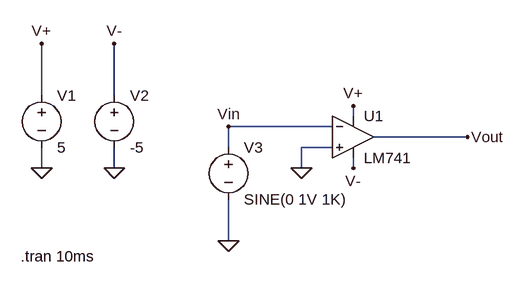
[diagram p0: schematic Lab_Task_1.asc]
Lab_Task_1.asc, the LTspice schematic file:
Version 4.1
SHEET 1 880 680
WIRE -304 96 -304 16
WIRE -192 96 -192 16
WIRE 176 128 176 112
WIRE 144 144 -16 144
WIRE 352 160 208 160
WIRE -16 176 -16 144
WIRE 144 176 96 176
WIRE -304 208 -304 176
WIRE -192 208 -192 176
WIRE 96 208 96 176
WIRE 176 208 176 192
WIRE -16 320 -16 256
FLAG 96 208 0
FLAG -16 320 0
FLAG 352 160 Vout
FLAG -16 144 Vin
FLAG -304 208 0
FLAG -192 208 0
FLAG -304 16 V+
FLAG -192 16 V-
FLAG 176 112 V+
FLAG 176 208 V-
SYMBOL OpAmps\\LM741 176 96 R0
SYMATTR InstName U1
SYMBOL voltage -16 160 R0
SYMATTR InstName V3
SYMATTR Value SINE(0 1V 1K)
SYMBOL voltage -304 80 R0
SYMATTR InstName V1
SYMATTR Value 5
SYMBOL voltage -192 80 R0
SYMATTR InstName V2
SYMATTR Value -5
TEXT -336 344 Left 2 !.tran 10ms

The netlist it stands for:
* Lab_Task_1.asc
X§U1 0 Vin V+ V- Vout LM741  ; pins In+ In- V+ V- OUT
V3 Vin 0 SINE(0 1V 1K)
V1 V+ 0 5
V2 V- 0 -5
.tran 10ms
.lib LM741.lib
.backanno
.end